# Altium schematic sheet STORAGE.SchDoc: FLASH, SD CARD
size 420 x 297 mm; SheetNumber: 5
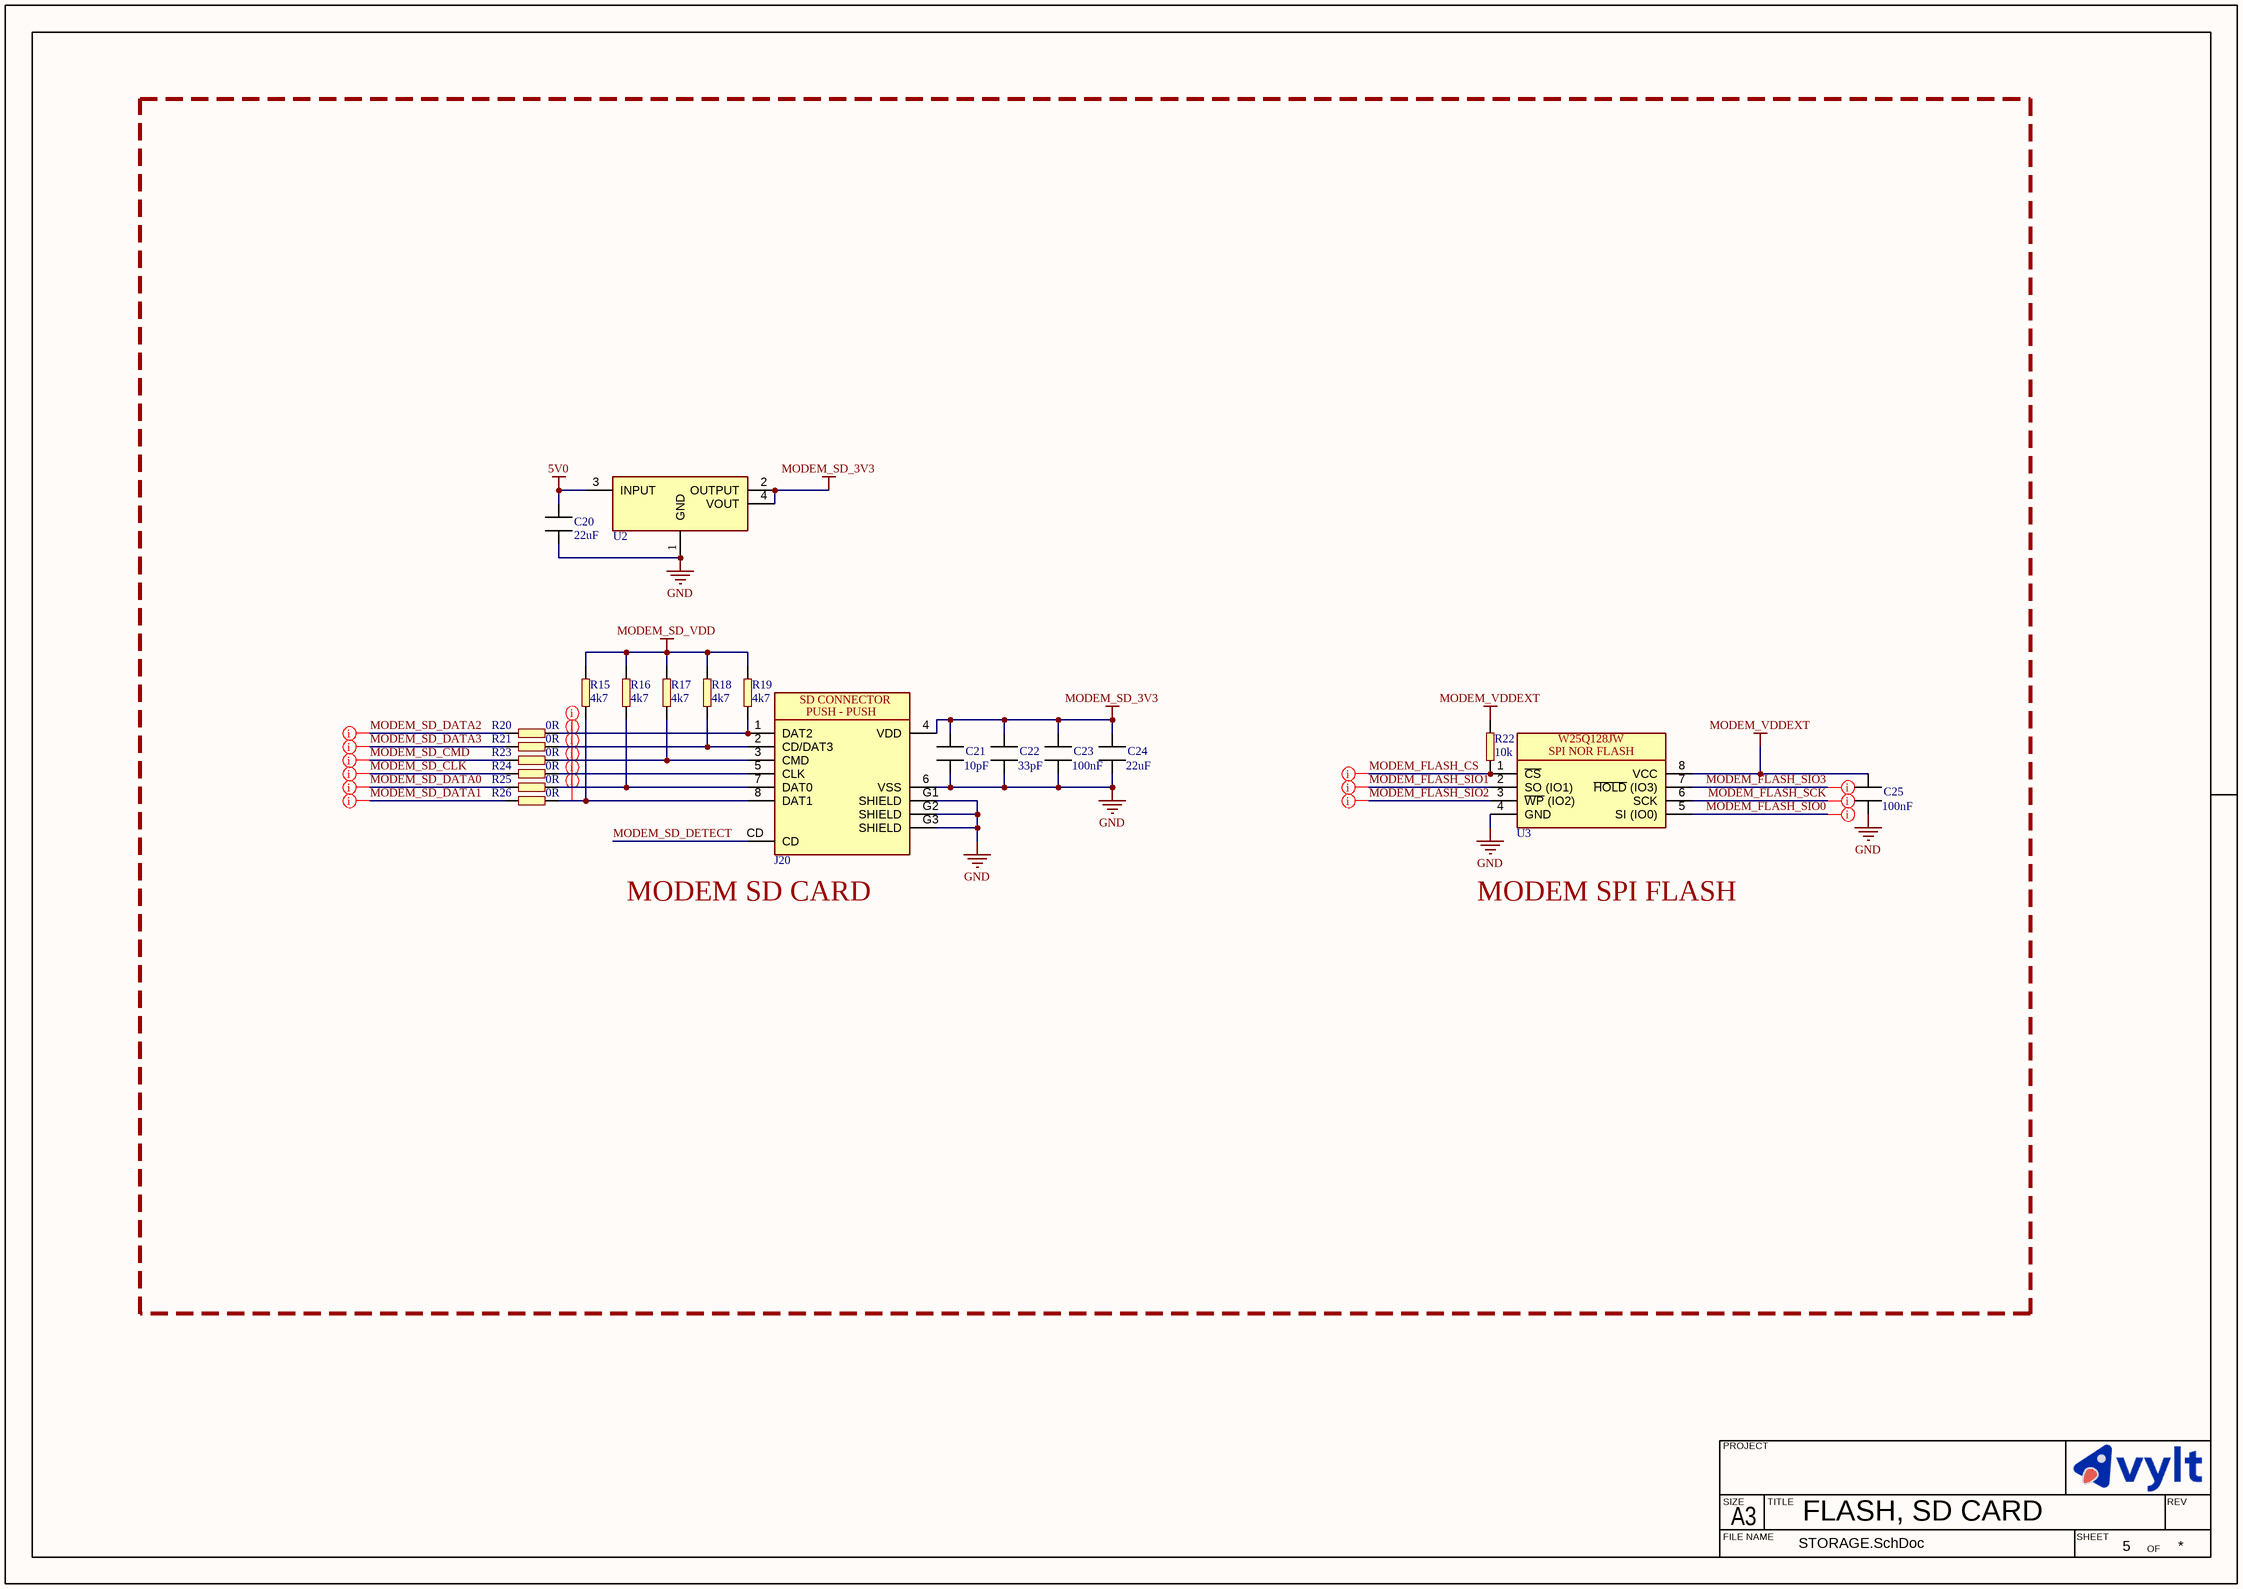
[diagram p0: STORAGE.SchDoc]

## Parts
C20  value 22uF  [CAPC2012X13L]  (hidden comment: MLCC_0805)
C21  value 10pF  [CAPC2012X13L]  (hidden comment: MLCC_0805)
C22  value 33pF  [CAPC2012X13L]  (hidden comment: MLCC_0805)
C23  value 100nF  [CAPC2012X13L]  (hidden comment: MLCC_0805)
C24  value 22uF  [CAPC2012X13L]  (hidden comment: MLCC_0805)
C25  value 100nF  [CAPC2012X13L]  (hidden comment: MLCC_0805)  (no BOM)
J20  GTFP084  [GTFP084]  (value not drawn)
R15  value 4k7  [RES_0603]  (hidden comment: ERP_101-1)
R16  value 4k7  [RES_0603]  (hidden comment: ERP_101-1)
R17  value 4k7  [RES_0603]  (hidden comment: ERP_101-1)
R18  value 4k7  [RES_0603]  (hidden comment: ERP_101-1)
R19  value 4k7  [RES_0603]  (hidden comment: ERP_101-1)
R20  value 0R  [RES_0603]  (hidden comment: ERP_101-1)  (no BOM)
R21  value 0R  [RES_0603]  (hidden comment: ERP_101-1)  (no BOM)
R22  value 10k  [RES_0603]  (hidden comment: ERP_101-1)  (no BOM)
R23  value 0R  [RES_0603]  (hidden comment: ERP_101-1)  (no BOM)
R24  value 0R  [RES_0603]  (hidden comment: ERP_101-1)  (no BOM)
R25  value 0R  [RES_0603]  (hidden comment: ERP_101-1)  (no BOM)
R26  value 0R  [RES_0603]  (hidden comment: ERP_101-1)  (no BOM)
U2  ERP_123-1  [AMS1117_SOT223]  (value not drawn)
U3  W25Q128JW  [SOIC127P800X216-8L]  (value not drawn)  (no BOM)

## Nets
5V0: C20.1 U2.3(INPUT)
GND: C20.2 C21.2 C22.2 C23.2 C24.2 C25.2 J20.6(VSS) J20.G1(SHIELD) J20.G2(SHIELD) J20.G3(SHIELD) U2.1(GND) U3.4(GND)
MODEM_SD_3V3: C21.1 C22.1 C23.1 C24.1 J20.4(VDD) U2.2(OUTPUT) U2.4(VOUT)
MODEM_SD_VDD: R15.2 R16.2 R17.2 R18.2 R19.2
MODEM_VDDEXT: C25.1 R22.2 U3.8(VCC)
MODEM_FLASH_CS: R22.1 U3.1(~{CS})
MODEM_FLASH_SCK: U3.6(SCK)
MODEM_FLASH_SIO0: U3.5(SI_(IO0))
MODEM_FLASH_SIO1: U3.2(SO_(IO1))
MODEM_FLASH_SIO2: U3.3(~{WP}_(IO2))
MODEM_FLASH_SIO3: U3.7(~{HOLD}_(IO3))
MODEM_SD_CLK: R24.2
MODEM_SD_CMD: R23.2
MODEM_SD_DATA0: R25.2
MODEM_SD_DATA1: R26.2
MODEM_SD_DATA2: R20.2
MODEM_SD_DATA3: R21.2
MODEM_SD_DETECT: J20.CD
NetJ20_1: J20.1(DAT2) R19.1 R20.1
NetJ20_2: J20.2(CD/DAT3) R18.1 R21.1
NetJ20_3: J20.3(CMD) R17.1 R23.1
NetJ20_5: J20.5(CLK) R24.1
NetJ20_7: J20.7(DAT0) R16.1 R25.1
NetJ20_8: J20.8(DAT1) R15.1 R26.1

## Layout directives
rule Width Constraint [Pref Impedance = 50.00ohms    Min Impedance = 50.00ohms    Max Impedance = 50.00ohms]: MODEM_FLASH_CS, MODEM_FLASH_SCK, MODEM_FLASH_SIO0, MODEM_FLASH_SIO1, MODEM_FLASH_SIO2, MODEM_FLASH_SIO3, MODEM_SD_CLK, MODEM_SD_CMD, MODEM_SD_DATA0, MODEM_SD_DATA1, MODEM_SD_DATA2, MODEM_SD_DATA3, NetJ20_1, NetJ20_2, NetJ20_3, NetJ20_5, NetJ20_7, NetJ20_8

## Notes on the sheet
- (near J20) MODEM SD CARD
- MODEM SPI FLASH
- PROJECT
- SIZE
- FILE NAME
- A3
- TITLE
- SHEET
- OF
- REV
- (in symbol GTFP084) SD CONNECTOR; PUSH - PUSH
- (in symbol W25Q128JW) SPI NOR FLASH

## Library data of the parts
C20-C25 = MLCC_0805: Chip Capacitor, 2-Leads, Body 2.00x1.25mm, IPC High Density; Package: 0805; Manufacturer 1: *; Manufacturer Part Number 1: *
J20 = GTFP084: 9 (8 + 1) Position Card Connector Secure Digital - microSD™ Surface Mount, Right Angle Gold; Manufacturer Part Number 1: GTFP08431BEU; Manufacturer 1: Amphenol; Package: 9 (8+1); Value: *; Supplier Part Number 1: 6172
R15-R26 = RES_0603: Package: 0603; Manufacturer 1: *; Manufacturer Part Number 1: *
U2 = AMS1117_SOT223: AMS1117 LDO; Manufacturer 1: TI; Supplier  Part Number 1: *; Supplier  1: *; Package: SOT223; Manufacturer Part Number 1: *
U3 = W25Q128JW: FLASH - NOR Memory IC SPI - Quad I/O 133 MHz 8-SOIC; Manufacturer 1: Winbond; Manufacturer Part Number 1: W25Q128JWSIQ; Package: 8-SOIC; Value: *; Supplier Part Number 1: 153-W25Q128JWSIQ